# Altium schematic sheet Fan Power Switch.SchDoc
size A4; Organization: TESLA Motors, INC; Address1: 3500 Deer Creek Road; Address2: Palo Alto, CA; Address4: U.S.A.; SheetNumber: 13; SheetTotal: 14
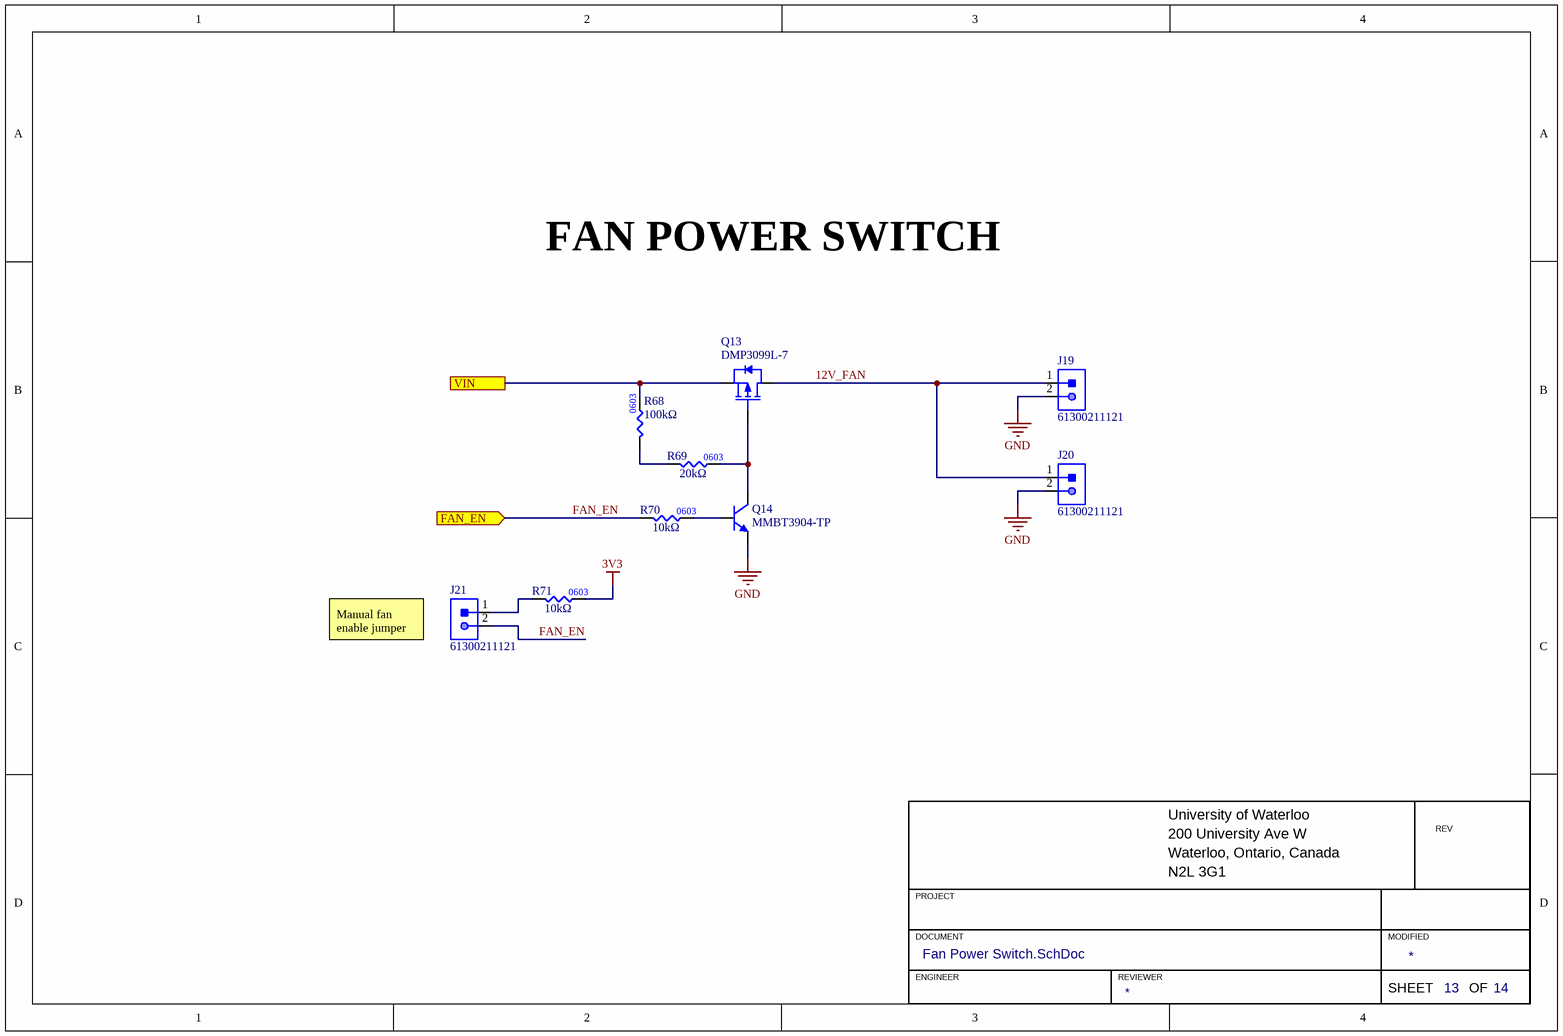
[diagram p0: Fan Power Switch.SchDoc]

## Parts
J19  Manufacturer Part Number 1: 61300211121  [HDR1X2]  (hidden comment: HEADER 2x1)
J20  Manufacturer Part Number 1: 61300211121  [HDR1X2]  (hidden comment: HEADER 2x1)
J21  Manufacturer Part Number 1: 61300211121  [HDR1X2]  (hidden comment: HEADER 2x1)
Q13  Manufacturer Part Number 1: DMP3099L-7  [DIO-INC_SOT23]  (hidden comment: PMOS_30V_3.8A)
Q14  Manufacturer Part Number 1: MMBT3904-TP  [SOT23-3]  (hidden comment: NPN_40V_100mA)
R68  value 100kΩ  [RES0603]  (hidden comment: RES_100kΩ_0603_1%)
R69  value 20kΩ  [RES0603]  (hidden comment: RES_20kΩ_0603_1%)
R70  value 10kΩ  [RES0603]  (hidden comment: RES_10kΩ_0603_1%)
R71  value 10kΩ  [RES0603]  (hidden comment: RES_10kΩ_0603_1%)

## Ports
FAN_EN (in), VIN

## Nets
3V3: R71.2
GND: J19.2 J20.2 Q14.2(E)
12V_FAN: J19.1(VCC) J20.1(VCC) Q13.3(Drain)
FAN_EN: J21.2 R70.1 ; port FAN_EN
VIN: Q13.2(Source) R68.2 ; port VIN
NetJ21_1: J21.1(VCC) R71.1
NetQ13_1: Q13.1(Gate) Q14.3(C) R69.2
NetQ14_1: Q14.1(B) R70.2
NetR68_1: R68.1 R69.1

## Notes on the sheet
- FAN POWER SWITCH
- Manual fan enable jumper
- University of Waterloo
- 200 University Ave W
- REV
- PROJECT
- Waterloo, Ontario, Canada
- N2L 3G1
- DOCUMENT
- ENGINEER
- REVIEWER
- MODIFIED
- SHEET
- OF
- (in symbol RES_20kΩ_0603_1%) 0603
- (in symbol RES_100kΩ_0603_1%) 0603

## Library data of the parts
J19-J21 = HEADER 2x1: Manufacturer 1: Würth Elektronik; Package/Footprint: TH; Mounting Type: TH; Supplier 1: Digi-Key; Supplier Part Number 1: 732-5315-ND
Q13 = PMOS_30V_3.8A: MOSFET P-CH 30V 3.8A SOT23; Manufacturer 1: Diodes Incorporated; Supplier 1: Digi-Key; Supplier Part Number 1: DMP3099L-7DICT-ND
Q14 = NPN_40V_100mA: TRANS NPN 40V 0.2A SOT23; Manufacturer 1: Micro Commercial Co; Package: SOT-23-3; Supplier Part Number 1: MMBT3904TPMSCT-ND; Supplier 1: Digi-Key
R68 = RES_100kΩ_0603_1%: RES 100K OHM 1% 1/10W 0603; Manufacturer 1: Yageo; Manufacturer Part Number 1: RC0603FR-07100KL; Supplier Part Number 1: 311-100KHRCT-ND; Supplier 1: Digi-Key
R69 = RES_20kΩ_0603_1%: RES 20K OHM 1% 1/10W 0603; Manufacturer 1: Yageo; Manufacturer Part Number 1: RC0603FR-0720KL; Supplier Part Number 1: 311-20.0KHRCT-ND; Supplier 1: Digi-Key
R70 R71 = RES_10kΩ_0603_1%: RES 10K OHM 1% 1/8W 0603; Manufacturer 1: Stackpole Electronics Inc; Manufacturer Part Number 1: RNCP0603FTD10K0; Supplier Part Number 1: RNCP0603FTD10K0CT-ND; Supplier 1: Digi-Key; Mounting Type: SMD; Package: 0603